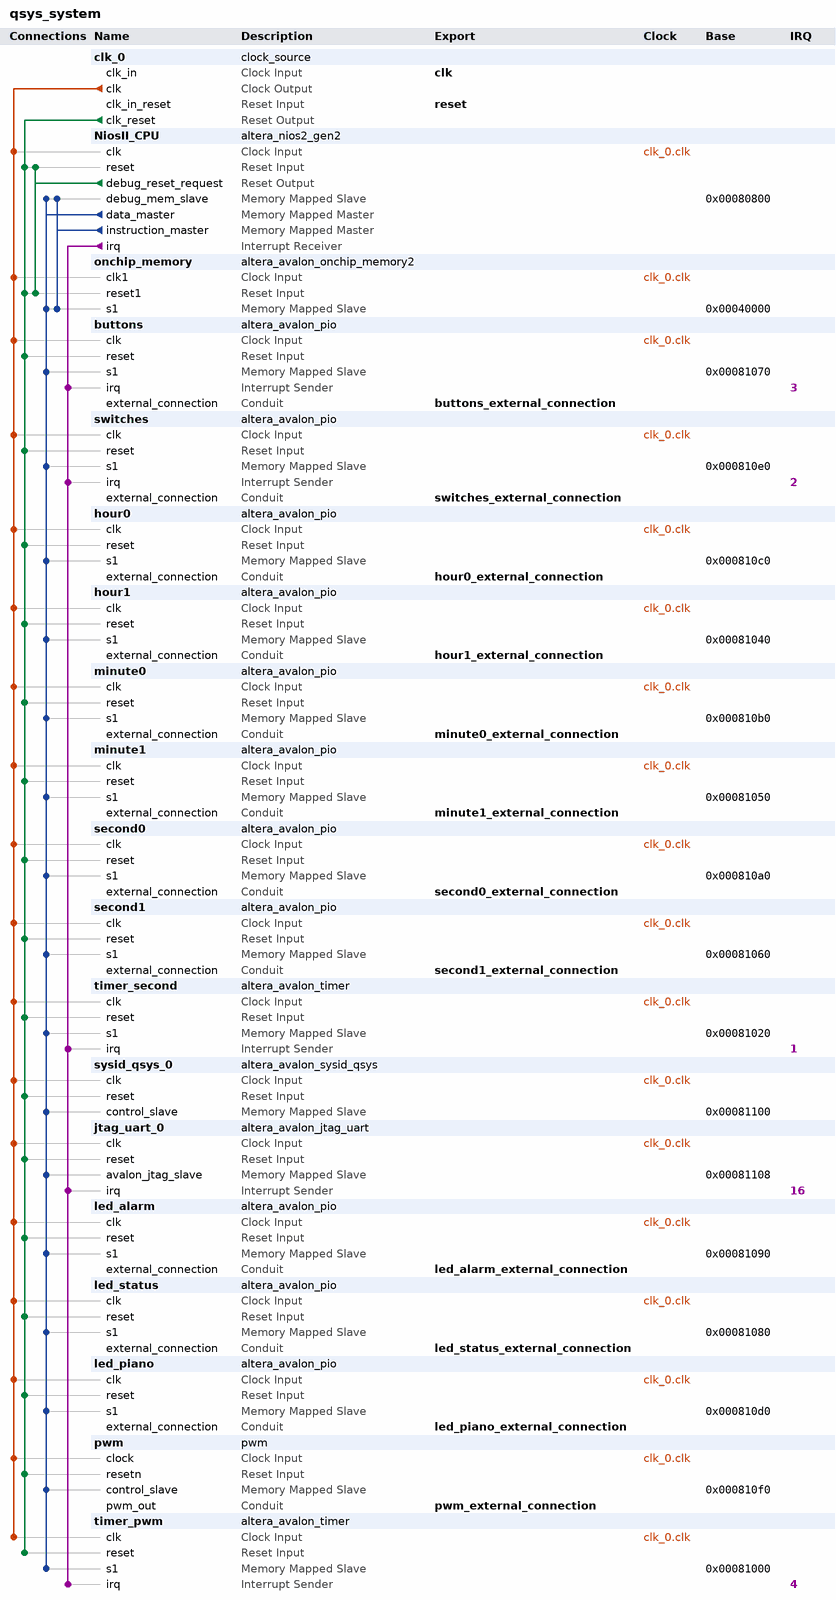
[diagram p0: system contents]
# Platform Designer (Qsys) system qsys_system, MAX 10 10M50DAF484C6GES
# Parameters at their usual value, and those the tool derives, are not listed.
package require -exact qsys 18.1
create_system qsys_system
set_project_property DEVICE_FAMILY {MAX 10}
set_project_property DEVICE 10M50DAF484C6GES

add_instance clk_0 clock_source 18.1
set_instance_parameter_value clk_0 clockFrequency 50000000

add_instance NiosII_CPU altera_nios2_gen2 18.1
set_instance_parameter_value NiosII_CPU dcache_size 0
set_instance_parameter_value NiosII_CPU exceptionSlave onchip_memory.s1
set_instance_parameter_value NiosII_CPU icache_size 2048
set_instance_parameter_value NiosII_CPU impl Fast
set_instance_parameter_value NiosII_CPU resetSlave onchip_memory.s1
set_instance_parameter_value NiosII_CPU setting_branchpredictiontype Static

add_instance onchip_memory altera_avalon_onchip_memory2 18.1
set_instance_parameter_value onchip_memory dataWidth 32
set_instance_parameter_value onchip_memory dualPort false
set_instance_parameter_value onchip_memory initMemContent false
set_instance_parameter_value onchip_memory initializationFileName onchip_mem.hex
set_instance_parameter_value onchip_memory memorySize 163840

add_instance buttons altera_avalon_pio 18.1
set_instance_parameter_value buttons captureEdge true
set_instance_parameter_value buttons direction Input
set_instance_parameter_value buttons generateIRQ true
set_instance_parameter_value buttons irqType EDGE
set_instance_parameter_value buttons width 2

add_instance switches altera_avalon_pio 18.1
set_instance_parameter_value switches captureEdge true
set_instance_parameter_value switches direction Input
set_instance_parameter_value switches edgeType ANY
set_instance_parameter_value switches generateIRQ true
set_instance_parameter_value switches irqType EDGE
set_instance_parameter_value switches width 10

add_instance hour0 altera_avalon_pio 18.1
set_instance_parameter_value hour0 direction Output
set_instance_parameter_value hour0 resetValue 64
set_instance_parameter_value hour0 width 8

add_instance hour1 altera_avalon_pio 18.1
set_instance_parameter_value hour1 direction Output
set_instance_parameter_value hour1 resetValue 64
set_instance_parameter_value hour1 width 8

add_instance minute0 altera_avalon_pio 18.1
set_instance_parameter_value minute0 direction Output
set_instance_parameter_value minute0 resetValue 64
set_instance_parameter_value minute0 width 8

add_instance minute1 altera_avalon_pio 18.1
set_instance_parameter_value minute1 direction Output
set_instance_parameter_value minute1 resetValue 64
set_instance_parameter_value minute1 width 8

add_instance second0 altera_avalon_pio 18.1
set_instance_parameter_value second0 direction Output
set_instance_parameter_value second0 resetValue 64
set_instance_parameter_value second0 width 8

add_instance second1 altera_avalon_pio 18.1
set_instance_parameter_value second1 direction Output
set_instance_parameter_value second1 resetValue 64
set_instance_parameter_value second1 width 8

add_instance timer_second altera_avalon_timer 18.1
set_instance_parameter_value timer_second period 1
set_instance_parameter_value timer_second periodUnits SEC

add_instance sysid_qsys_0 altera_avalon_sysid_qsys 18.1
set_instance_parameter_value sysid_qsys_0 id 305419896

add_instance jtag_uart_0 altera_avalon_jtag_uart 18.1
set_instance_parameter_value jtag_uart_0 simInteractiveOptions NO_INTERACTIVE_WINDOWS

add_instance led_alarm altera_avalon_pio 18.1
set_instance_parameter_value led_alarm direction Output
set_instance_parameter_value led_alarm width 1

add_instance led_status altera_avalon_pio 18.1
set_instance_parameter_value led_status direction Output
set_instance_parameter_value led_status width 2

add_instance led_piano altera_avalon_pio 18.1
set_instance_parameter_value led_piano direction Output
set_instance_parameter_value led_piano width 7

add_instance pwm pwm 1.0
set_instance_parameter_value pwm clock_divide_reg_init 0
set_instance_parameter_value pwm duty_cycle_reg_init 0

add_instance timer_pwm altera_avalon_timer 18.1
set_instance_parameter_value timer_pwm period 2
set_instance_parameter_value timer_pwm periodUnits MSEC

# connections
add_connection clk_0.clk buttons.clk clock
add_connection clk_0.clk hour0.clk clock
add_connection clk_0.clk hour1.clk clock
add_connection clk_0.clk jtag_uart_0.clk clock
add_connection clk_0.clk led_alarm.clk clock
add_connection clk_0.clk led_piano.clk clock
add_connection clk_0.clk led_status.clk clock
add_connection clk_0.clk minute0.clk clock
add_connection clk_0.clk minute1.clk clock
add_connection clk_0.clk NiosII_CPU.clk clock
add_connection clk_0.clk onchip_memory.clk1 clock
add_connection clk_0.clk pwm.clock clock
add_connection clk_0.clk second0.clk clock
add_connection clk_0.clk second1.clk clock
add_connection clk_0.clk switches.clk clock
add_connection clk_0.clk sysid_qsys_0.clk clock
add_connection clk_0.clk timer_pwm.clk clock
add_connection clk_0.clk timer_second.clk clock
add_connection clk_0.clk_reset buttons.reset reset
add_connection clk_0.clk_reset hour0.reset reset
add_connection clk_0.clk_reset hour1.reset reset
add_connection clk_0.clk_reset jtag_uart_0.reset reset
add_connection clk_0.clk_reset led_alarm.reset reset
add_connection clk_0.clk_reset led_piano.reset reset
add_connection clk_0.clk_reset led_status.reset reset
add_connection clk_0.clk_reset minute0.reset reset
add_connection clk_0.clk_reset minute1.reset reset
add_connection clk_0.clk_reset NiosII_CPU.reset reset
add_connection clk_0.clk_reset onchip_memory.reset1 reset
add_connection clk_0.clk_reset pwm.resetn reset
add_connection clk_0.clk_reset second0.reset reset
add_connection clk_0.clk_reset second1.reset reset
add_connection clk_0.clk_reset switches.reset reset
add_connection clk_0.clk_reset sysid_qsys_0.reset reset
add_connection clk_0.clk_reset timer_pwm.reset reset
add_connection clk_0.clk_reset timer_second.reset reset
add_connection NiosII_CPU.debug_reset_request NiosII_CPU.reset reset
add_connection NiosII_CPU.debug_reset_request onchip_memory.reset1 reset
add_connection NiosII_CPU.data_master buttons.s1 avalon
set_connection_parameter_value NiosII_CPU.data_master/buttons.s1 baseAddress 0x00081070
add_connection NiosII_CPU.data_master hour0.s1 avalon
set_connection_parameter_value NiosII_CPU.data_master/hour0.s1 baseAddress 0x000810c0
add_connection NiosII_CPU.data_master hour1.s1 avalon
set_connection_parameter_value NiosII_CPU.data_master/hour1.s1 baseAddress 0x00081040
add_connection NiosII_CPU.data_master jtag_uart_0.avalon_jtag_slave avalon
set_connection_parameter_value NiosII_CPU.data_master/jtag_uart_0.avalon_jtag_slave baseAddress 0x00081108
add_connection NiosII_CPU.data_master led_alarm.s1 avalon
set_connection_parameter_value NiosII_CPU.data_master/led_alarm.s1 baseAddress 0x00081090
add_connection NiosII_CPU.data_master led_piano.s1 avalon
set_connection_parameter_value NiosII_CPU.data_master/led_piano.s1 baseAddress 0x000810d0
add_connection NiosII_CPU.data_master led_status.s1 avalon
set_connection_parameter_value NiosII_CPU.data_master/led_status.s1 baseAddress 0x00081080
add_connection NiosII_CPU.data_master minute0.s1 avalon
set_connection_parameter_value NiosII_CPU.data_master/minute0.s1 baseAddress 0x000810b0
add_connection NiosII_CPU.data_master minute1.s1 avalon
set_connection_parameter_value NiosII_CPU.data_master/minute1.s1 baseAddress 0x00081050
add_connection NiosII_CPU.data_master NiosII_CPU.debug_mem_slave avalon
set_connection_parameter_value NiosII_CPU.data_master/NiosII_CPU.debug_mem_slave baseAddress 0x00080800
add_connection NiosII_CPU.data_master onchip_memory.s1 avalon
set_connection_parameter_value NiosII_CPU.data_master/onchip_memory.s1 baseAddress 0x00040000
add_connection NiosII_CPU.data_master pwm.control_slave avalon
set_connection_parameter_value NiosII_CPU.data_master/pwm.control_slave baseAddress 0x000810f0
add_connection NiosII_CPU.data_master second0.s1 avalon
set_connection_parameter_value NiosII_CPU.data_master/second0.s1 baseAddress 0x000810a0
add_connection NiosII_CPU.data_master second1.s1 avalon
set_connection_parameter_value NiosII_CPU.data_master/second1.s1 baseAddress 0x00081060
add_connection NiosII_CPU.data_master switches.s1 avalon
set_connection_parameter_value NiosII_CPU.data_master/switches.s1 baseAddress 0x000810e0
add_connection NiosII_CPU.data_master sysid_qsys_0.control_slave avalon
set_connection_parameter_value NiosII_CPU.data_master/sysid_qsys_0.control_slave baseAddress 0x00081100
add_connection NiosII_CPU.data_master timer_pwm.s1 avalon
set_connection_parameter_value NiosII_CPU.data_master/timer_pwm.s1 baseAddress 0x00081000
add_connection NiosII_CPU.data_master timer_second.s1 avalon
set_connection_parameter_value NiosII_CPU.data_master/timer_second.s1 baseAddress 0x00081020
add_connection NiosII_CPU.instruction_master NiosII_CPU.debug_mem_slave avalon
set_connection_parameter_value NiosII_CPU.instruction_master/NiosII_CPU.debug_mem_slave baseAddress 0x00080800
add_connection NiosII_CPU.instruction_master onchip_memory.s1 avalon
set_connection_parameter_value NiosII_CPU.instruction_master/onchip_memory.s1 baseAddress 0x00040000
add_connection NiosII_CPU.irq buttons.irq interrupt
set_connection_parameter_value NiosII_CPU.irq/buttons.irq irqNumber 3
add_connection NiosII_CPU.irq jtag_uart_0.irq interrupt
set_connection_parameter_value NiosII_CPU.irq/jtag_uart_0.irq irqNumber 16
add_connection NiosII_CPU.irq switches.irq interrupt
set_connection_parameter_value NiosII_CPU.irq/switches.irq irqNumber 2
add_connection NiosII_CPU.irq timer_pwm.irq interrupt
set_connection_parameter_value NiosII_CPU.irq/timer_pwm.irq irqNumber 4
add_connection NiosII_CPU.irq timer_second.irq interrupt
set_connection_parameter_value NiosII_CPU.irq/timer_second.irq irqNumber 1

# exported interfaces
add_interface buttons_external_connection conduit end
set_interface_property buttons_external_connection EXPORT_OF buttons.external_connection
add_interface clk clock sink
set_interface_property clk EXPORT_OF clk_0.clk_in
add_interface hour0_external_connection conduit end
set_interface_property hour0_external_connection EXPORT_OF hour0.external_connection
add_interface hour1_external_connection conduit end
set_interface_property hour1_external_connection EXPORT_OF hour1.external_connection
add_interface led_alarm_external_connection conduit end
set_interface_property led_alarm_external_connection EXPORT_OF led_alarm.external_connection
add_interface led_piano_external_connection conduit end
set_interface_property led_piano_external_connection EXPORT_OF led_piano.external_connection
add_interface led_status_external_connection conduit end
set_interface_property led_status_external_connection EXPORT_OF led_status.external_connection
add_interface minute0_external_connection conduit end
set_interface_property minute0_external_connection EXPORT_OF minute0.external_connection
add_interface minute1_external_connection conduit end
set_interface_property minute1_external_connection EXPORT_OF minute1.external_connection
add_interface pwm_external_connection conduit end
set_interface_property pwm_external_connection EXPORT_OF pwm.pwm_out
add_interface reset reset sink
set_interface_property reset EXPORT_OF clk_0.clk_in_reset
add_interface second0_external_connection conduit end
set_interface_property second0_external_connection EXPORT_OF second0.external_connection
add_interface second1_external_connection conduit end
set_interface_property second1_external_connection EXPORT_OF second1.external_connection
add_interface switches_external_connection conduit end
set_interface_property switches_external_connection EXPORT_OF switches.external_connection

set_interconnect_requirement {$system} qsys_mm.clockCrossingAdapter HANDSHAKE
set_interconnect_requirement {$system} qsys_mm.enableEccProtection FALSE
set_interconnect_requirement {$system} qsys_mm.insertDefaultSlave FALSE
set_interconnect_requirement {$system} qsys_mm.maxAdditionalLatency 1

save_system qsys_system.qsys
